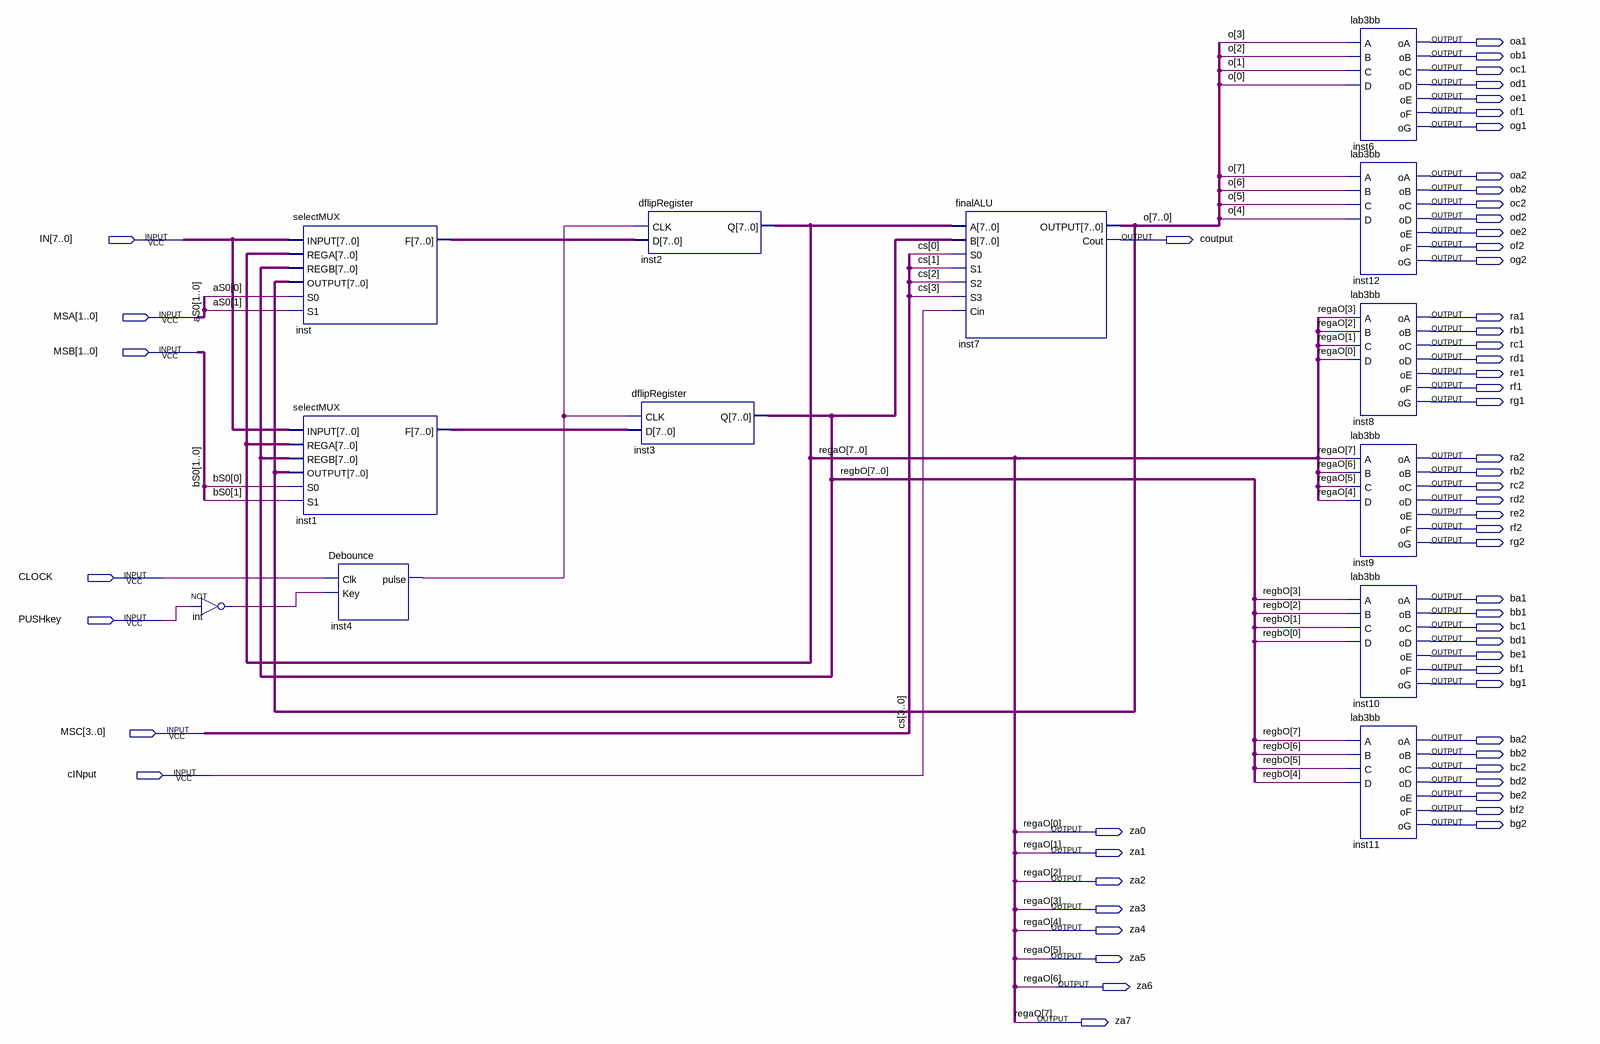
[diagram p0: schematic sheet]
// Quartus schematic constructedALU.bdf as structural Verilog: 13 symbols, 58 pins
module constructedALU (
  input  [7:0] IN,
  input  [1:0] MSA,
  input  [1:0] MSB,
  input  CLOCK,
  input  PUSHkey,
  input  [3:0] MSC,
  input  cINput,
  output oa1,
  output ob1,
  output oc1,
  output od1,
  output oe1,
  output of1,
  output og1,
  output oa2,
  output ob2,
  output oc2,
  output od2,
  output oe2,
  output coutput,
  output of2,
  output og2,
  output ra1,
  output rb1,
  output rc1,
  output rd1,
  output re1,
  output rf1,
  output rg1,
  output ra2,
  output rb2,
  output rc2,
  output rd2,
  output re2,
  output rf2,
  output rg2,
  output ba1,
  output bb1,
  output bc1,
  output bd1,
  output be1,
  output bf1,
  output bg1,
  output ba2,
  output bb2,
  output bc2,
  output bd2,
  output be2,
  output bf2,
  output bg2,
  output za0,
  output za1,
  output za2,
  output za3,
  output za4,
  output za5,
  output za6,
  output za7
);

  wire inst4_pulse, int_out;
  wire [7:0] inst1_f, inst_f, o, regbO;

  not \int  (int_out, PUSHkey);
  selectMUX inst (
    .INPUT(IN), .REGA({za7, za6, za5, za4, za3, za2, za1, za0}), .REGB(regbO), .OUTPUT(o), .S0(MSA[0]),
    .S1(MSA[1]), .F(inst_f));
  selectMUX inst1 (
    .INPUT(IN), .REGA({za7, za6, za5, za4, za3, za2, za1, za0}), .REGB(regbO), .OUTPUT(o), .S0(MSB[0]),
    .S1(MSB[1]), .F(inst1_f));
  Debounce inst4 (.Clk(CLOCK), .Key(int_out), .pulse(inst4_pulse));
  dflipRegister inst2 (.CLK(inst4_pulse), .D(inst_f), .Q({za7, za6, za5, za4, za3, za2, za1, za0}));
  dflipRegister inst3 (.CLK(inst4_pulse), .D(inst1_f), .Q(regbO));
  finalALU inst7 (
    .A({za7, za6, za5, za4, za3, za2, za1, za0}), .B(regbO), .S0(MSC[0]), .S1(MSC[1]), .S2(MSC[2]),
    .S3(MSC[3]), .Cin(cINput), .OUTPUT(o), .Cout(coutput));
  lab3bb inst6 (
    .A(o[3]), .B(o[2]), .C(o[1]), .D(o[0]), .oA(oa1), .oB(ob1), .oC(oc1), .oD(od1), .oE(oe1), .oF(of1),
    .oG(og1));
  lab3bb inst12 (
    .A(o[7]), .B(o[6]), .C(o[5]), .D(o[4]), .oA(oa2), .oB(ob2), .oC(oc2), .oD(od2), .oE(oe2), .oF(of2),
    .oG(og2));
  lab3bb inst8 (
    .A(za3), .B(za2), .C(za1), .D(za0), .oA(ra1), .oB(rb1), .oC(rc1), .oD(rd1), .oE(re1), .oF(rf1), .oG(rg1));
  lab3bb inst9 (
    .A(za7), .B(za6), .C(za5), .D(za4), .oA(ra2), .oB(rb2), .oC(rc2), .oD(rd2), .oE(re2), .oF(rf2), .oG(rg2));
  lab3bb inst10 (
    .A(regbO[3]), .B(regbO[2]), .C(regbO[1]), .D(regbO[0]), .oA(ba1), .oB(bb1), .oC(bc1), .oD(bd1), .oE(be1),
    .oF(bf1), .oG(bg1));
  lab3bb inst11 (
    .A(regbO[7]), .B(regbO[6]), .C(regbO[5]), .D(regbO[4]), .oA(ba2), .oB(bb2), .oC(bc2), .oD(bd2), .oE(be2),
    .oF(bf2), .oG(bg2));

  // Other names for the same wires on the sheet: aS0[1:0] = MSA; bS0[1:0] = MSB; cs[3:0] = MSC;
  //   regaO[7:0] = {za7, za6, za5, za4, za3, za2, za1, za0}
endmodule
